# EasyEDA Pro project Lab Exercise Schematics with ESP32_Part B.eprj

# Schematic 2. Parallel Circuit Schematic
Create Date: 2026-05-11; Page Name: Circuit 2 (Parallel); Project Name: Lab Exercise Schematics with ESP32; Schematic Name: Schematic2; Update Date: 2026-05-12; Company: EasyEDA.com; Page Size: A4; Version: V1.0
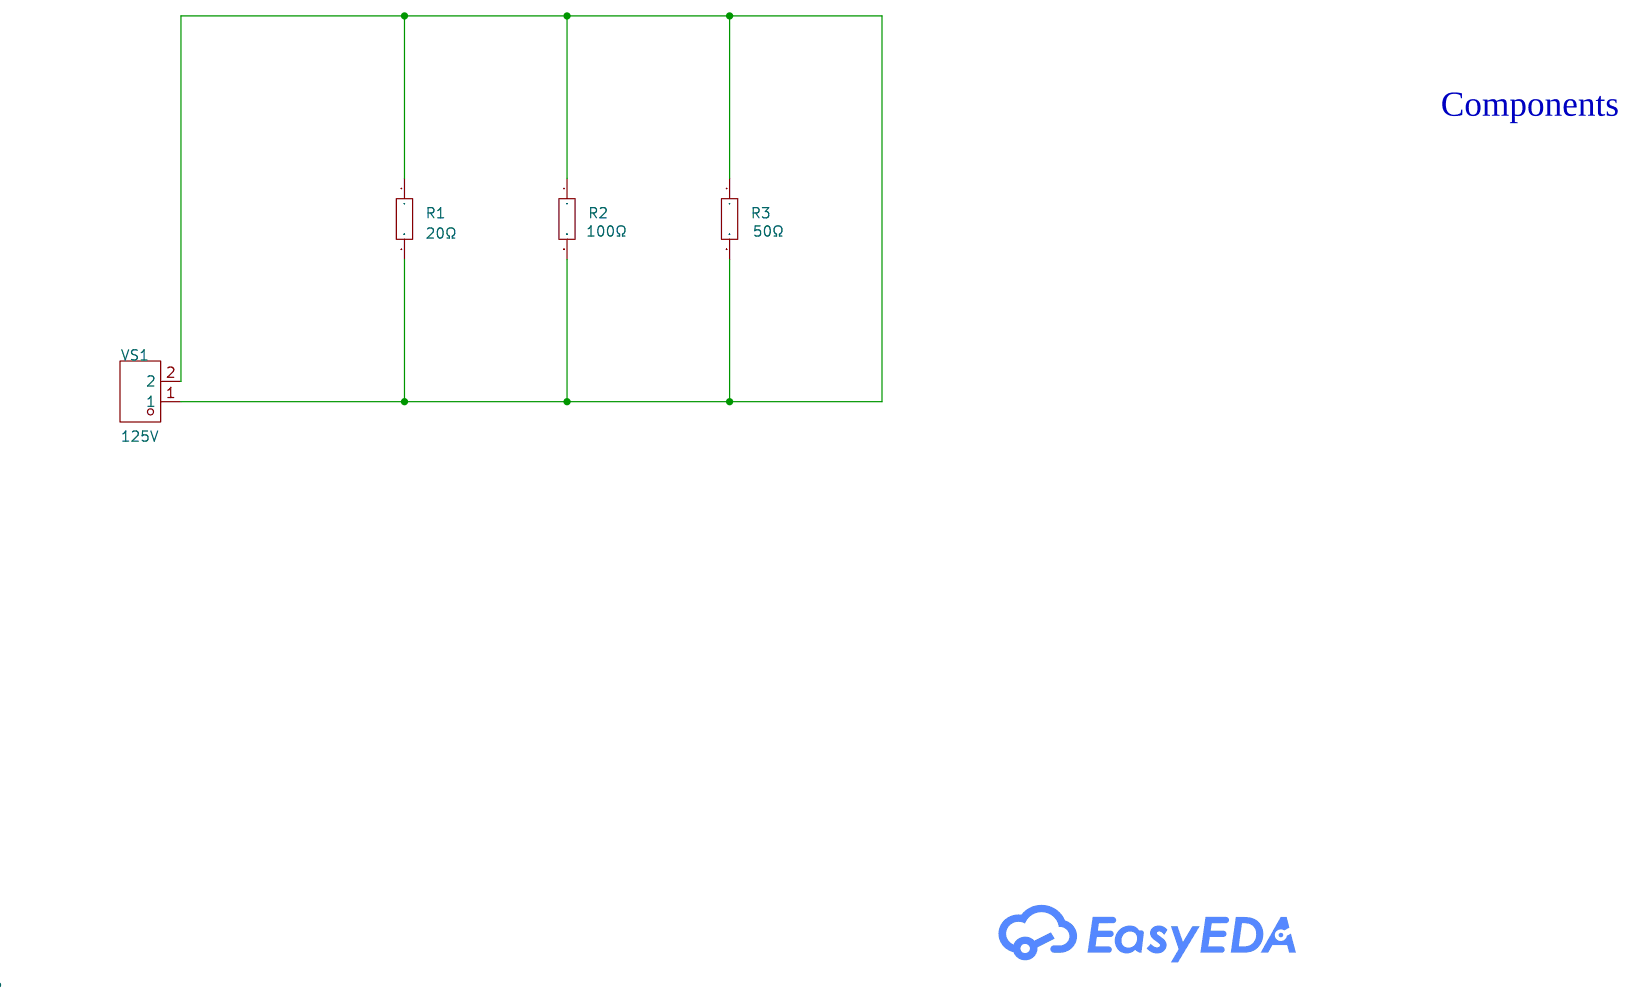
[diagram p0: schematic sheet]

## Parts
R1  20Ω  [R0603]
R2  100Ω  [R0603]
R3  50Ω  [R0603]
VS1  125V  [CONN-TH_DB-8-5DP9]

## Library data of the parts
R1-R3 = Res_0603: Supplier Footprint: 0603
VS1 = DB-8-5DP9: LCSC Part Name: 交流输入口额定电流和耐压; Supplier Part: C7429381; Manufacturer: HCTL(华灿天禄); Supplier Footprint: 弯插; JLCPCB Part Class: Extended Part; Datasheet: https://item.szlcsc.com/datasheet/DB-8-5DP9/8426833.html; Supplier: LCSC; Standard: IEC 320-C8; Number of Ports: 1; PIN Number Per Port: 2; Mounting Type: Right Angle; Current Rating: 7A

## Nets
Net-(R1-1): R1.1 R1.2 R2.1 R2.2 R3.1 R3.2 VS1.1 VS1.2

## Notes on the sheet
- Components

# Schematic 3. ESP32/DHT22 Schematic
Create Date: 2026-05-11; Page Name: ESP32/DHT22 Schematic Connection; Project Name: Lab Exercise Schematics with ESP32; Schematic Name: Schematic3; Update Date: 2026-05-15; Company: EasyEDA.com; Page Size: A4; Version: V1.0
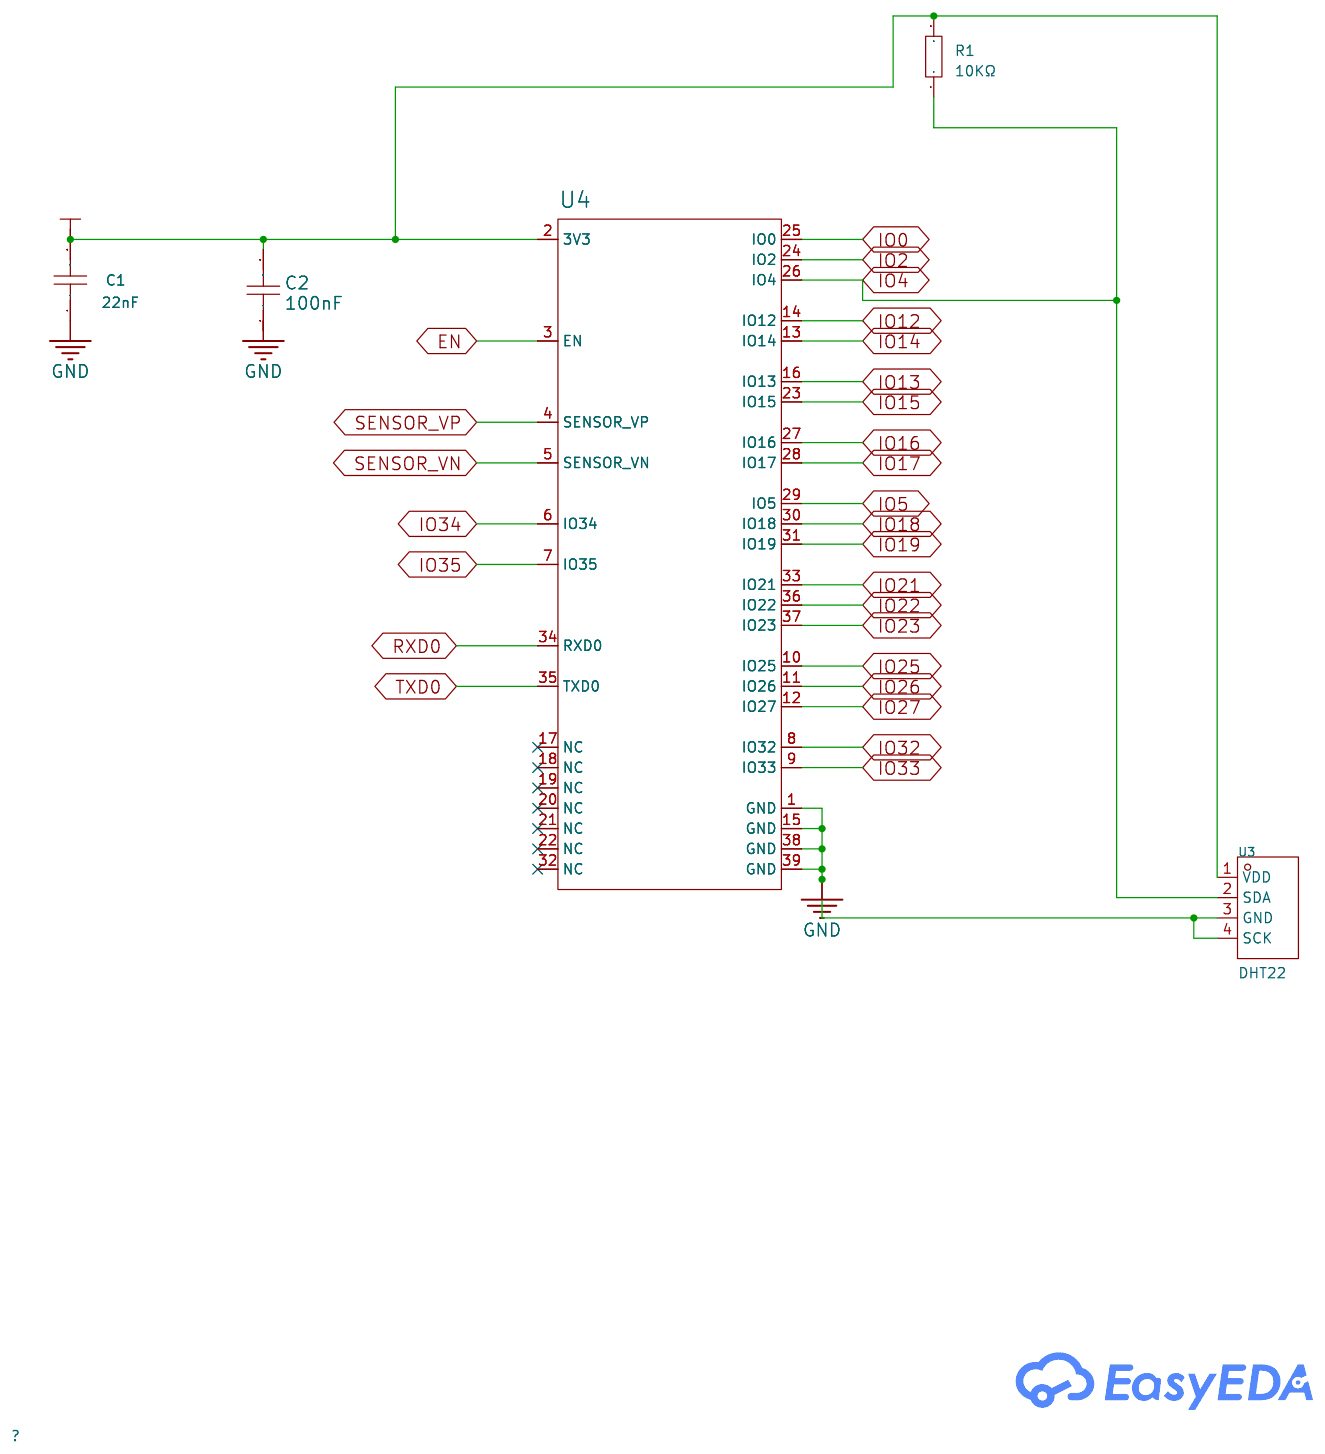
[diagram p1: schematic sheet]

## Parts
C1  22nF  [C0402]
C2  100nF  [C0402]
R1  10KΩ  [R0603]
U3  DHT22  [SENSOR-TH_HAIGU_DHT22]
U4  ESP32-WROOM-32E-N8  [WIFI-SMD_ESP32-WROOM-32E]

## Library data of the parts
C1 = CL05B223KA5NNNC: Capacitance: Tolerance:±10% Tolerance:±10% Voltage Rated: Temperature Coefficient:; LCSC Part Name: 22nF ±10% 25V; Supplier Part: C318578; Manufacturer: SAMSUNG(三星); Supplier Footprint: 0402; JLCPCB Part Class: Extended Part; Datasheet: https://atta.szlcsc.com/upload/public/pdf/source/20160218/1457707763339.pdf; Supplier: LCSC; Tolerance: ±10%
C2 = CL05B104KO5NNNC: Capacitance: Tolerance:±10% Tolerance:±10% Voltage Rated: Temperature Coefficient:; LCSC Part Name: 100nF ±10% 16V; Supplier Part: C1525; Manufacturer: SAMSUNG(三星); Supplier Footprint: 0402; JLCPCB Part Class: Basic Part; Datasheet: https://atta.szlcsc.com/upload/public/pdf/source/20160218/1457707763339.pdf; Supplier: LCSC; Tolerance: ±10%
R1 = Res_0603: Supplier Footprint: 0603
U3 = DHT22: Temperature:-40℃~+80℃ Temperature:-40℃~+80℃ Humidity:5%RH~99%RH Humidity:5%RH~99%RH Supply Voltage:3.3V Supply Voltage:3.3V Supply Current:500uA Resolution:±3%RH Resolution:±3%RH; LCSC Part Name: 数字温湿度模块12mm*15.5mm*5.9mm; Supplier Part: C2880291; Manufacturer: HAIGU(广州海谷); Supplier Footprint: 插件; JLCPCB Part Class: Extended Part; Datasheet: https://atta.szlcsc.com/upload/public/pdf/source/20230523/7507864DBB8AF99FF82B5DD1568971DB.pdf; Supplier: LCSC; Temperature: -40℃~+80℃; Humidity: 5%RH~99%RH; Supply Voltage: 3.3V; Supply Current: 500uA; Resolution: ±3%RH
U4 = ESP32-WROOM-32E-N8: Supplier: LCSC; Supplier Part: C701342; Manufacturer: ESPRESSIF(乐鑫); JLCPCB Part Class: Extended Part; LCSC Part Name: 通用型Wi-Fi+BT+BLE MCU模组; Supplier Footprint: SMD,18x25.5mm; Datasheet: https://atta.szlcsc.com/upload/public/pdf/source/20200730/C701341_95E089979D39CD8D2471FDC7C7AF29A1.pdf

## Nets
+3V3: C1.2 C2.2 R1.2 U3.1(VDD) U4.2(3V3)
GND: C1.1 C2.1 U3.3(GND) U3.4(SCK) U4.1(GND) U4.15(GND) U4.38(GND) U4.39(GND)
EN: U4.3(EN)
IO0: U4.25(IO0)
IO2: U4.24(IO2)
IO4: R1.1 U3.2(SDA) U4.26(IO4)
IO5: U4.29(IO5)
IO12: U4.14(IO12)
IO13: U4.16(IO13)
IO14: U4.13(IO14)
IO15: U4.23(IO15)
IO16: U4.27(IO16)
IO17: U4.28(IO17)
IO18: U4.30(IO18)
IO19: U4.31(IO19)
IO21: U4.33(IO21)
IO22: U4.36(IO22)
IO23: U4.37(IO23)
IO25: U4.10(IO25)
IO26: U4.11(IO26)
IO27: U4.12(IO27)
IO32: U4.8(IO32)
IO33: U4.9(IO33)
IO34: U4.6(IO34)
IO35: U4.7(IO35)
RXD0: U4.34(RXD0)
SENSOR_VN: U4.5(SENSOR_VN)
SENSOR_VP: U4.4(SENSOR_VP)
TXD0: U4.35(TXD0)

Not connected (* = marked no-connect by the designer): U4 17(NC)* 18(NC)* 19(NC)* 20(NC)* 21(NC)* 22(NC)* 32(NC)*

# Schematic 1. Series Circuit Schematic
Create Date: 2026-05-15; Page Name: Series Circuit; Project Name: Lab Exercise Schematics with ESP32; Schematic Name: Series Circuit Schematic; Update Date: 2026-05-15; Company: EasyEDA.com; Page Size: A4; Version: V1.0
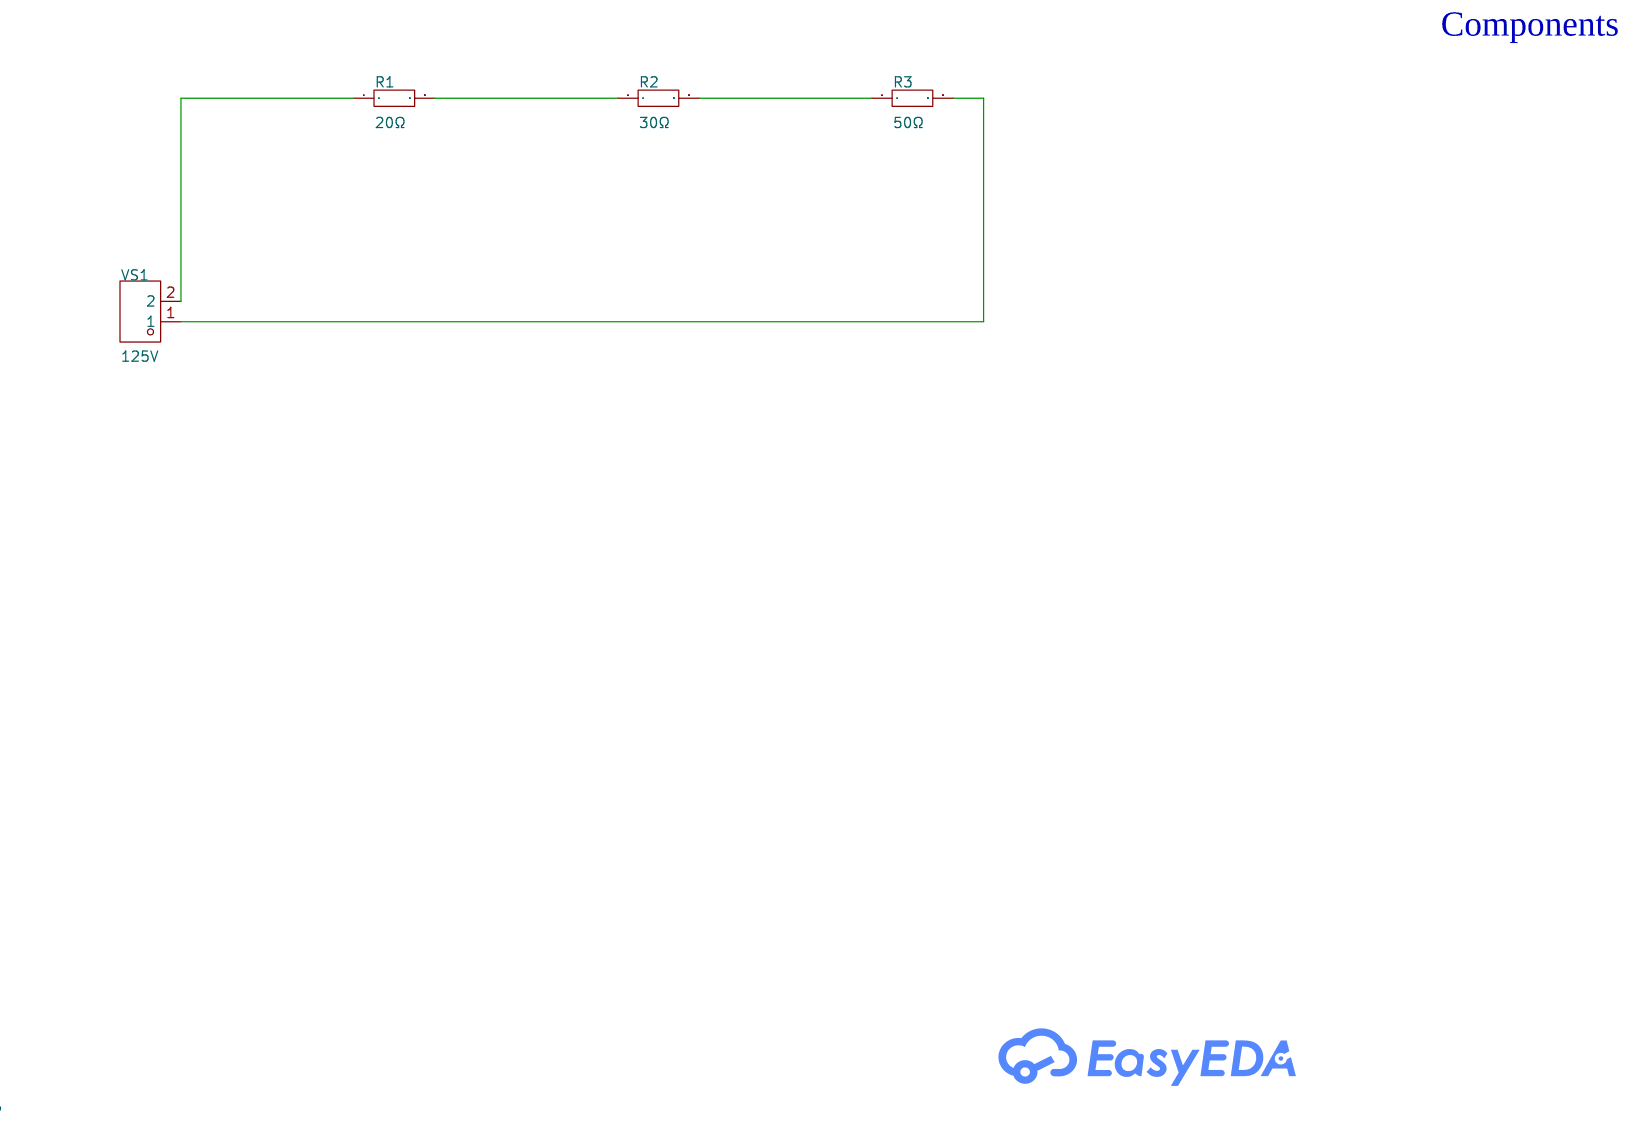
[diagram p2: schematic sheet]

## Parts
R1  20Ω  [R0603]
R2  30Ω  [R0603]
R3  50Ω  [R0603]
VS1  125V  [CONN-TH_DB-8-5DP9]

## Library data of the parts
R1-R3 = Res_0603: Supplier Footprint: 0603
VS1 = DB-8-5DP9: LCSC Part Name: 交流输入口额定电流和耐压; Supplier Part: C7429381; Manufacturer: HCTL(华灿天禄); Supplier Footprint: 弯插; JLCPCB Part Class: Extended Part; Datasheet: https://item.szlcsc.com/datasheet/DB-8-5DP9/8426833.html; Supplier: LCSC; Standard: IEC 320-C8; Number of Ports: 1; PIN Number Per Port: 2; Mounting Type: Right Angle; Current Rating: 7A

## Nets
Net-(R1-1): R1.1 VS1.2
Net-(R1-2): R1.2 R2.1
Net-(R2-2): R2.2 R3.1
Net-(R3-2): R3.2 VS1.1

## Notes on the sheet
- Components
